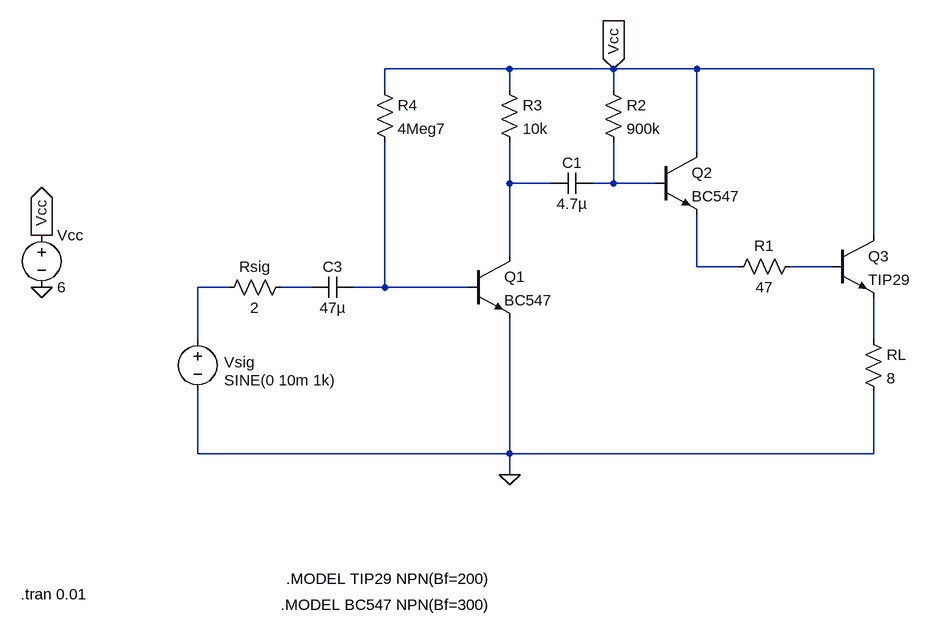
[diagram p0: schematic TBJ - Radio - AM - mod.asc]
TBJ - Radio - AM - mod.asc, the LTspice schematic file:
Version 4
SHEET 1 3324 696
WIRE 208 -144 16 -144
WIRE 368 -144 208 -144
WIRE 496 -144 368 -144
WIRE 768 -144 496 -144
WIRE 16 -112 16 -144
WIRE 208 -112 208 -144
WIRE 368 -112 368 -144
WIRE 496 -16 496 -144
WIRE 208 32 208 -32
WIRE 272 32 208 32
WIRE 368 32 368 -32
WIRE 368 32 336 32
WIRE 432 32 368 32
WIRE 768 112 768 -144
WIRE 208 144 208 32
WIRE 496 160 496 80
WIRE 560 160 496 160
WIRE 704 160 640 160
WIRE -224 192 -272 192
WIRE -96 192 -144 192
WIRE 16 192 16 -32
WIRE 16 192 -32 192
WIRE 144 192 16 192
WIRE -272 272 -272 192
WIRE 768 272 768 208
WIRE -272 448 -272 352
WIRE 208 448 208 240
WIRE 208 448 -272 448
WIRE 768 448 768 352
WIRE 768 448 208 448
WIRE 208 480 208 448
FLAG 208 480 0
FLAG -512 192 0
FLAG -512 112 Vcc
IOPIN -512 112 Out
FLAG 368 -144 Vcc
IOPIN 368 -144 In
SYMBOL npn 144 144 R0
SYMATTR InstName Q1
SYMATTR Value BC547
SYMBOL npn 432 -16 R0
SYMATTR InstName Q2
SYMATTR Value BC547
SYMBOL npn 704 112 R0
SYMATTR InstName Q3
SYMATTR Value TIP29
SYMBOL res 752 256 R0
SYMATTR InstName RL
SYMATTR Value 8
SYMBOL res 656 144 R90
WINDOW 0 0 56 VBottom 2
WINDOW 3 32 56 VTop 2
SYMATTR InstName R1
SYMATTR Value 47
SYMBOL res 352 -128 R0
SYMATTR InstName R2
SYMATTR Value 900k
SYMBOL res 192 -128 R0
SYMATTR InstName R3
SYMATTR Value 10k
SYMBOL res 0 -128 R0
SYMATTR InstName R4
SYMATTR Value 4Meg7
SYMBOL cap 336 16 R90
WINDOW 0 0 32 VBottom 2
WINDOW 3 32 32 VTop 2
SYMATTR InstName C1
SYMATTR Value 4.7µ
SYMBOL cap -32 176 R90
WINDOW 0 0 32 VBottom 2
WINDOW 3 32 32 VTop 2
SYMATTR InstName C3
SYMATTR Value 47µ
SYMBOL voltage -272 256 R0
WINDOW 123 36 91 Left 2
WINDOW 39 0 0 Left 0
WINDOW 0 41 51 Left 2
WINDOW 3 41 79 Left 2
SYMATTR InstName Vsig
SYMATTR Value SINE(0 10m 1k)
SYMBOL voltage -512 96 R0
WINDOW 123 0 0 Left 0
WINDOW 39 0 0 Left 0
SYMATTR InstName Vcc
SYMATTR Value 6
SYMBOL res -128 176 R90
WINDOW 0 0 56 VBottom 2
WINDOW 3 32 56 VTop 2
SYMATTR InstName Rsig
SYMATTR Value 2
TEXT -136 640 Left 2 !.MODEL TIP29 NPN(Bf=200)
TEXT -544 664 Left 2 !.tran 0.01
TEXT -144 680 Left 2 !.MODEL BC547 NPN(Bf=300)

The netlist it stands for:
* TBJ - Radio - AM - mod.asc
Q1 N001 N007 0 0 BC547
Q2 Vcc N002 N003 0 BC547
Q3 Vcc N004 N008 0 TIP29
RL N008 0 8
R1 N004 N003 47
R2 Vcc N002 900k
R3 Vcc N001 10k
R4 Vcc N007 4Meg7
C1 N002 N001 4.7µ
C3 N007 N006 47µ
Vsig N005 0 SINE(0 10m 1k)
Vcc Vcc 0 6
Rsig N006 N005 2
.model NPN NPN
.model PNP PNP
.lib standard.bjt
.MODEL TIP29 NPN(Bf=200)
.tran 0.01
.MODEL BC547 NPN(Bf=300)
.backanno
.end